# EAGLE schematic tappytap_6x6_connopposite (EAGLE 6.5.0)

## Sheet 1 of 4
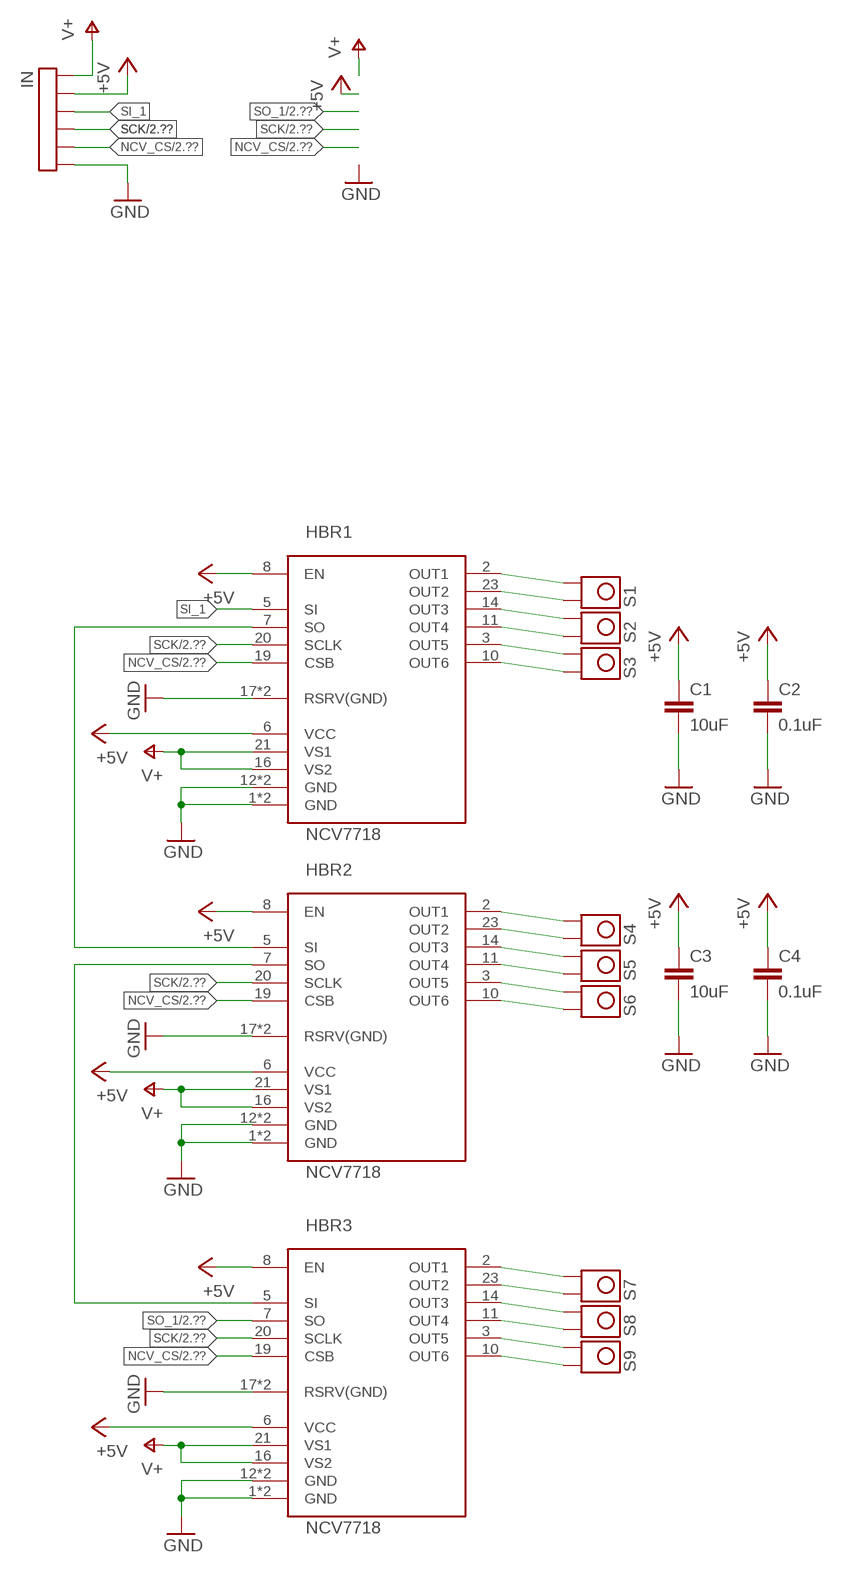
[diagram p0: schematic, sheet 1]

### Parts
C1  10uF  C-EUC0603  [C0603]
C2  0.1uF  C-EUC0603  [C0603]
C3  10uF  C-EUC0603  [C0603]
C4  0.1uF  C-EUC0603  [C0603]
HBR1  NCV7718  [SSOP-24]
HBR2  NCV7718  [SSOP-24]
HBR3  NCV7718  [SSOP-24]
IN  TP6  [TP6_2MM]
S1  TP_6MM_BIG_PAD  [TP_6MM_BIG_PAD]
S2  TP_6MM_BIG_PAD  [TP_6MM_BIG_PAD]
S3  TP_6MM_BIG_PAD  [TP_6MM_BIG_PAD]
S4  TP_6MM_BIG_PAD  [TP_6MM_BIG_PAD]
S5  TP_6MM_BIG_PAD  [TP_6MM_BIG_PAD]
S6  TP_6MM_BIG_PAD  [TP_6MM_BIG_PAD]
S7  TP_6MM_BIG_PAD  [TP_6MM_BIG_PAD]
S8  TP_6MM_BIG_PAD  [TP_6MM_BIG_PAD]
S9  TP_6MM_BIG_PAD  [TP_6MM_BIG_PAD]

### Nets
+5V [usbvcc]: C1.1 C2.1 C3.1 C4.1 HBR1.6(VCC) HBR1.8(EN) HBR2.6(VCC) HBR2.8(EN) HBR3.6(VCC) HBR3.8(EN) IN.P$5 ; also sheet 2,3,4
GND [gnd]: C1.2 C2.2 C3.2 C4.2 HBR1.1(GND) HBR1.12(GND) HBR1.13(GND) HBR1.17(RSRV(GND)) HBR1.18(RSRV(GND)) HBR1.24(GND) HBR2.1(GND) HBR2.12(GND) HBR2.13(GND) HBR2.17(RSRV(GND)) HBR2.18(RSRV(GND)) HBR2.24(GND) HBR3.1(GND) HBR3.12(GND) HBR3.13(GND) HBR3.17(RSRV(GND)) HBR3.18(RSRV(GND)) HBR3.24(GND) IN.P$1 ; also sheet 2,3,4
N$24: HBR1.7(SO) HBR2.5(SI)
N$26: HBR2.7(SO) HBR3.5(SI)
NCV_CS: HBR1.19(CSB) HBR2.19(CSB) HBR3.19(CSB) IN.P$2 ; also sheet 2,3,4
S1A: HBR1.2(OUT1) S1.P$1
S1B: HBR1.23(OUT2) S1.P$2
S2A: HBR1.14(OUT3) S2.P$1
S2B: HBR1.11(OUT4) S2.P$2
S3A: HBR1.3(OUT5) S3.P$1
S3B: HBR1.10(OUT6) S3.P$2
S4A: HBR2.2(OUT1) S4.P$1
S4B: HBR2.23(OUT2) S4.P$2
S5A: HBR2.14(OUT3) S5.P$1
S5B: HBR2.11(OUT4) S5.P$2
S6A: HBR2.3(OUT5) S6.P$1
S6B: HBR2.10(OUT6) S6.P$2
S7A: HBR3.2(OUT1) S7.P$1
S7B: HBR3.23(OUT2) S7.P$2
S8A: HBR3.14(OUT3) S8.P$1
S8B: HBR3.11(OUT4) S8.P$2
S9A: HBR3.3(OUT5) S9.P$1
S9B: HBR3.10(OUT6) S9.P$2
SCK: HBR1.20(SCLK) HBR2.20(SCLK) HBR3.20(SCLK) IN.P$3 ; also sheet 2,3,4
SI_1: HBR1.5(SI) IN.P$4
SO_1: HBR3.7(SO) ; also sheet 2
V+: HBR1.16(VS2) HBR1.21(VS1) HBR2.16(VS2) HBR2.21(VS1) HBR3.16(VS2) HBR3.21(VS1) IN.P$6 ; also sheet 2,3,4

## Sheet 2 of 4
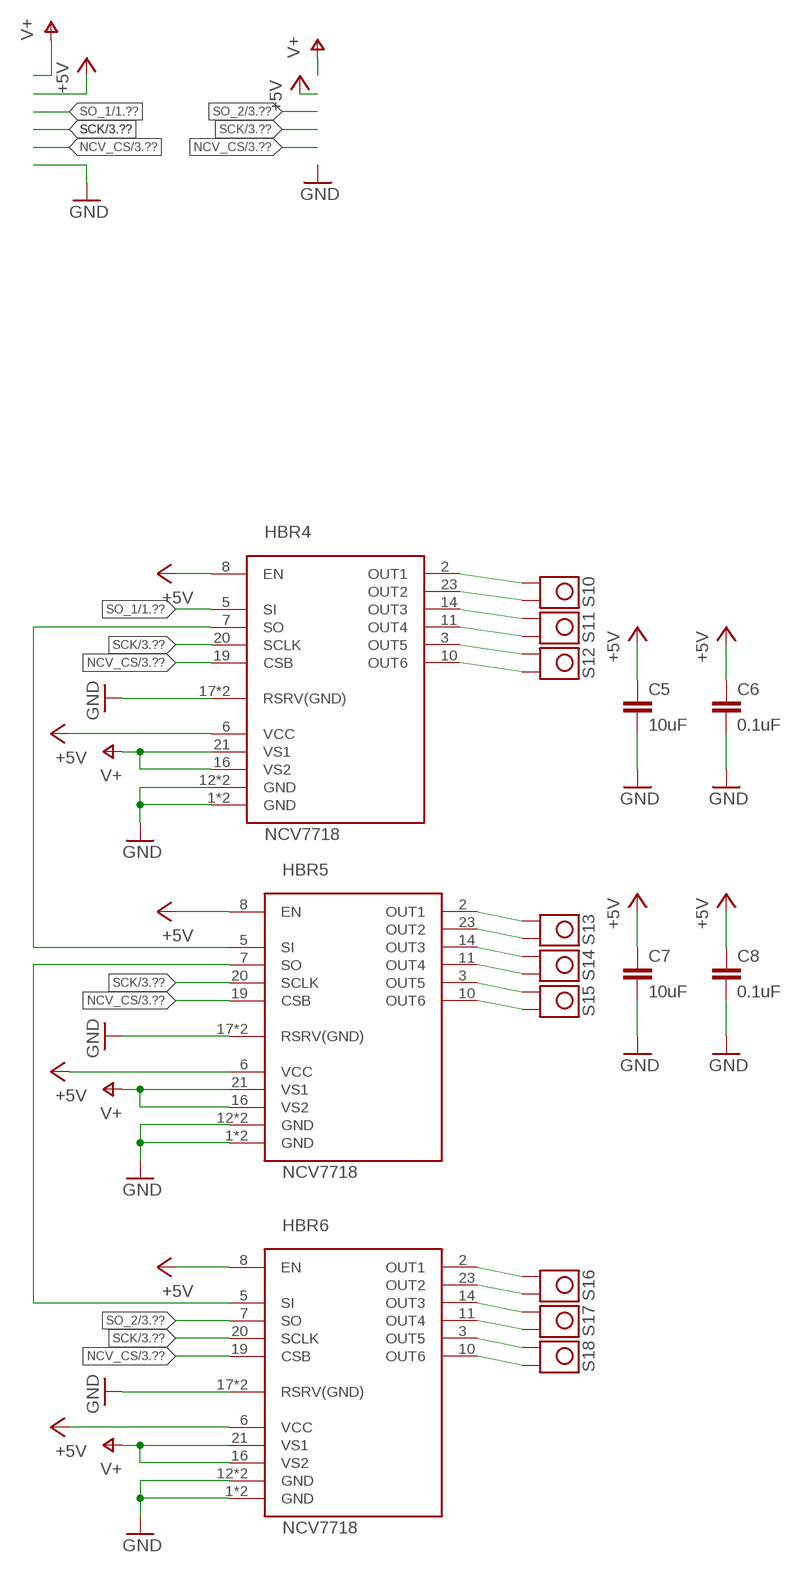
[diagram p1: schematic, sheet 2]

### Parts
C5  10uF  C-EUC0603  [C0603]
C6  0.1uF  C-EUC0603  [C0603]
C7  10uF  C-EUC0603  [C0603]
C8  0.1uF  C-EUC0603  [C0603]
HBR4  NCV7718  [SSOP-24]
HBR5  NCV7718  [SSOP-24]
HBR6  NCV7718  [SSOP-24]
S10  TP_6MM_BIG_PAD  [TP_6MM_BIG_PAD]
S11  TP_6MM_BIG_PAD  [TP_6MM_BIG_PAD]
S12  TP_6MM_BIG_PAD  [TP_6MM_BIG_PAD]
S13  TP_6MM_BIG_PAD  [TP_6MM_BIG_PAD]
S14  TP_6MM_BIG_PAD  [TP_6MM_BIG_PAD]
S15  TP_6MM_BIG_PAD  [TP_6MM_BIG_PAD]
S16  TP_6MM_BIG_PAD  [TP_6MM_BIG_PAD]
S17  TP_6MM_BIG_PAD  [TP_6MM_BIG_PAD]
S18  TP_6MM_BIG_PAD  [TP_6MM_BIG_PAD]

### Nets
+5V [usbvcc]: C5.1 C6.1 C7.1 C8.1 HBR4.6(VCC) HBR4.8(EN) HBR5.6(VCC) HBR5.8(EN) HBR6.6(VCC) HBR6.8(EN) ; also sheet 1,3,4
GND [gnd]: C5.2 C6.2 C7.2 C8.2 HBR4.1(GND) HBR4.12(GND) HBR4.13(GND) HBR4.17(RSRV(GND)) HBR4.18(RSRV(GND)) HBR4.24(GND) HBR5.1(GND) HBR5.12(GND) HBR5.13(GND) HBR5.17(RSRV(GND)) HBR5.18(RSRV(GND)) HBR5.24(GND) HBR6.1(GND) HBR6.12(GND) HBR6.13(GND) HBR6.17(RSRV(GND)) HBR6.18(RSRV(GND)) HBR6.24(GND) ; also sheet 1,3,4
N$1: HBR4.7(SO) HBR5.5(SI)
N$2: HBR5.7(SO) HBR6.5(SI)
NCV_CS: HBR4.19(CSB) HBR5.19(CSB) HBR6.19(CSB) ; also sheet 1,3,4
S1A1: HBR4.2(OUT1) S10.P$1
S1B1: HBR4.23(OUT2) S10.P$2
S2A1: HBR4.14(OUT3) S11.P$1
S2B1: HBR4.11(OUT4) S11.P$2
S3A1: HBR4.3(OUT5) S12.P$1
S3B1: HBR4.10(OUT6) S12.P$2
S4A1: HBR5.2(OUT1) S13.P$1
S4B1: HBR5.23(OUT2) S13.P$2
S5A1: HBR5.14(OUT3) S14.P$1
S5B1: HBR5.11(OUT4) S14.P$2
S6A1: HBR5.3(OUT5) S15.P$1
S6B1: HBR5.10(OUT6) S15.P$2
S7A1: HBR6.2(OUT1) S16.P$1
S7B1: HBR6.23(OUT2) S16.P$2
S8A1: HBR6.14(OUT3) S17.P$1
S8B1: HBR6.11(OUT4) S17.P$2
S9A1: HBR6.3(OUT5) S18.P$1
S9B1: HBR6.10(OUT6) S18.P$2
SCK: HBR4.20(SCLK) HBR5.20(SCLK) HBR6.20(SCLK) ; also sheet 1,3,4
SO_1: HBR4.5(SI) ; also sheet 1
SO_2: HBR6.7(SO) ; also sheet 3
V+: HBR4.16(VS2) HBR4.21(VS1) HBR5.16(VS2) HBR5.21(VS1) HBR6.16(VS2) HBR6.21(VS1) ; also sheet 1,3,4

## Sheet 3 of 4
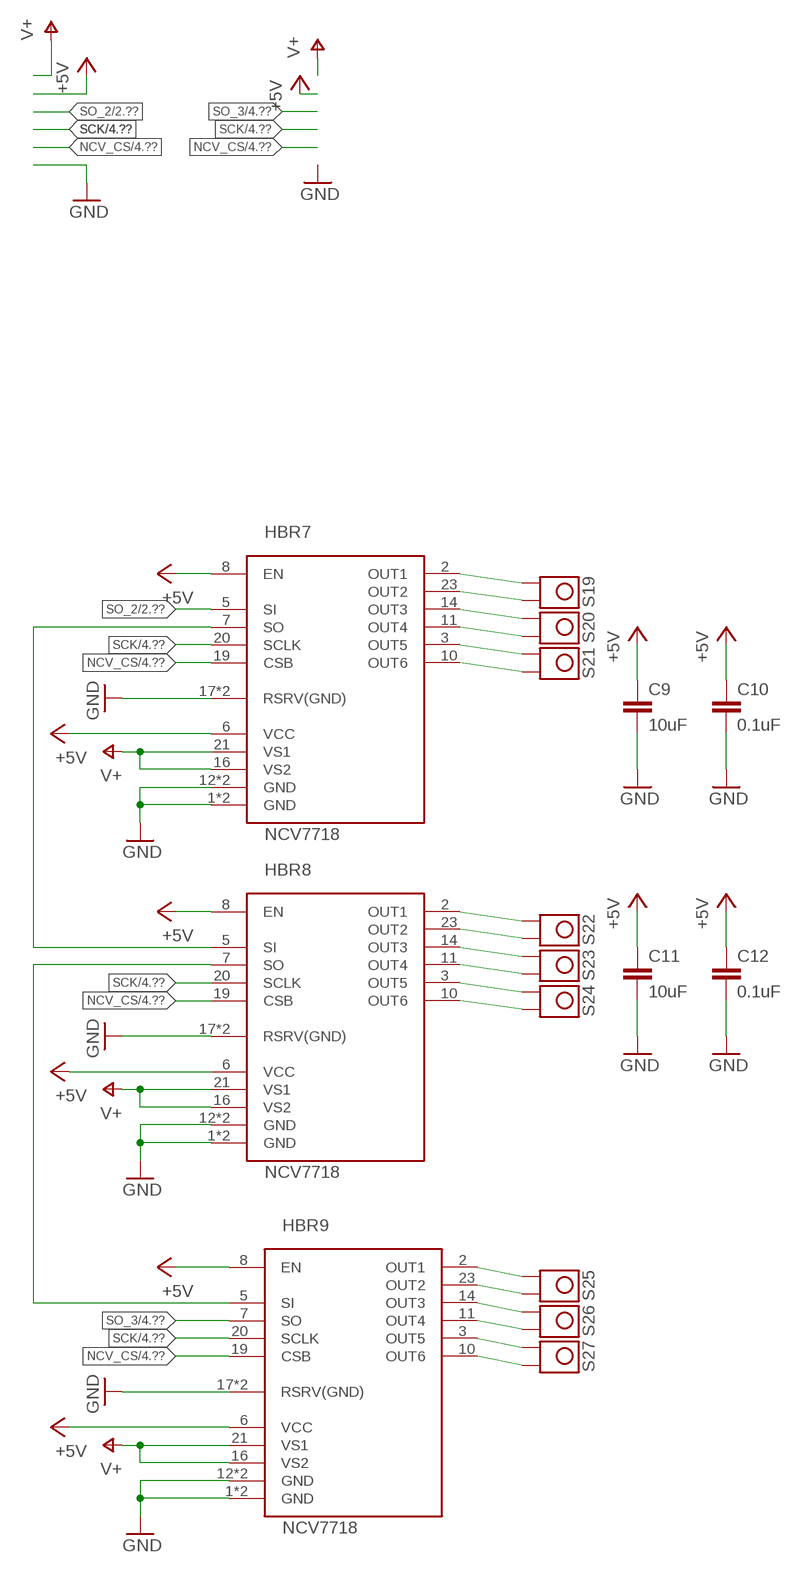
[diagram p2: schematic, sheet 3]

### Parts
C9  10uF  C-EUC0603  [C0603]
C10  0.1uF  C-EUC0603  [C0603]
C11  10uF  C-EUC0603  [C0603]
C12  0.1uF  C-EUC0603  [C0603]
HBR7  NCV7718  [SSOP-24]
HBR8  NCV7718  [SSOP-24]
HBR9  NCV7718  [SSOP-24]
S19  TP_6MM_BIG_PAD  [TP_6MM_BIG_PAD]
S20  TP_6MM_BIG_PAD  [TP_6MM_BIG_PAD]
S21  TP_6MM_BIG_PAD  [TP_6MM_BIG_PAD]
S22  TP_6MM_BIG_PAD  [TP_6MM_BIG_PAD]
S23  TP_6MM_BIG_PAD  [TP_6MM_BIG_PAD]
S24  TP_6MM_BIG_PAD  [TP_6MM_BIG_PAD]
S25  TP_6MM_BIG_PAD  [TP_6MM_BIG_PAD]
S26  TP_6MM_BIG_PAD  [TP_6MM_BIG_PAD]
S27  TP_6MM_BIG_PAD  [TP_6MM_BIG_PAD]

### Nets
+5V [usbvcc]: C9.1 C10.1 C11.1 C12.1 HBR7.6(VCC) HBR7.8(EN) HBR8.6(VCC) HBR8.8(EN) HBR9.6(VCC) HBR9.8(EN) ; also sheet 1,2,4
GND [gnd]: C9.2 C10.2 C11.2 C12.2 HBR7.1(GND) HBR7.12(GND) HBR7.13(GND) HBR7.17(RSRV(GND)) HBR7.18(RSRV(GND)) HBR7.24(GND) HBR8.1(GND) HBR8.12(GND) HBR8.13(GND) HBR8.17(RSRV(GND)) HBR8.18(RSRV(GND)) HBR8.24(GND) HBR9.1(GND) HBR9.12(GND) HBR9.13(GND) HBR9.17(RSRV(GND)) HBR9.18(RSRV(GND)) HBR9.24(GND) ; also sheet 1,2,4
N$3: HBR7.7(SO) HBR8.5(SI)
N$4: HBR8.7(SO) HBR9.5(SI)
NCV_CS: HBR7.19(CSB) HBR8.19(CSB) HBR9.19(CSB) ; also sheet 1,2,4
S1A2: HBR7.2(OUT1) S19.P$1
S1B2: HBR7.23(OUT2) S19.P$2
S2A2: HBR7.14(OUT3) S20.P$1
S2B2: HBR7.11(OUT4) S20.P$2
S3A2: HBR7.3(OUT5) S21.P$1
S3B2: HBR7.10(OUT6) S21.P$2
S4A2: HBR8.2(OUT1) S22.P$1
S4B2: HBR8.23(OUT2) S22.P$2
S5A2: HBR8.14(OUT3) S23.P$1
S5B2: HBR8.11(OUT4) S23.P$2
S6A2: HBR8.3(OUT5) S24.P$1
S6B2: HBR8.10(OUT6) S24.P$2
S7A2: HBR9.2(OUT1) S25.P$1
S7B2: HBR9.23(OUT2) S25.P$2
S8A2: HBR9.14(OUT3) S26.P$1
S8B2: HBR9.11(OUT4) S26.P$2
S9A2: HBR9.3(OUT5) S27.P$1
S9B2: HBR9.10(OUT6) S27.P$2
SCK: HBR7.20(SCLK) HBR8.20(SCLK) HBR9.20(SCLK) ; also sheet 1,2,4
SO_2: HBR7.5(SI) ; also sheet 2
SO_3: HBR9.7(SO) ; also sheet 4
V+: HBR7.16(VS2) HBR7.21(VS1) HBR8.16(VS2) HBR8.21(VS1) HBR9.16(VS2) HBR9.21(VS1) ; also sheet 1,2,4

## Sheet 4 of 4
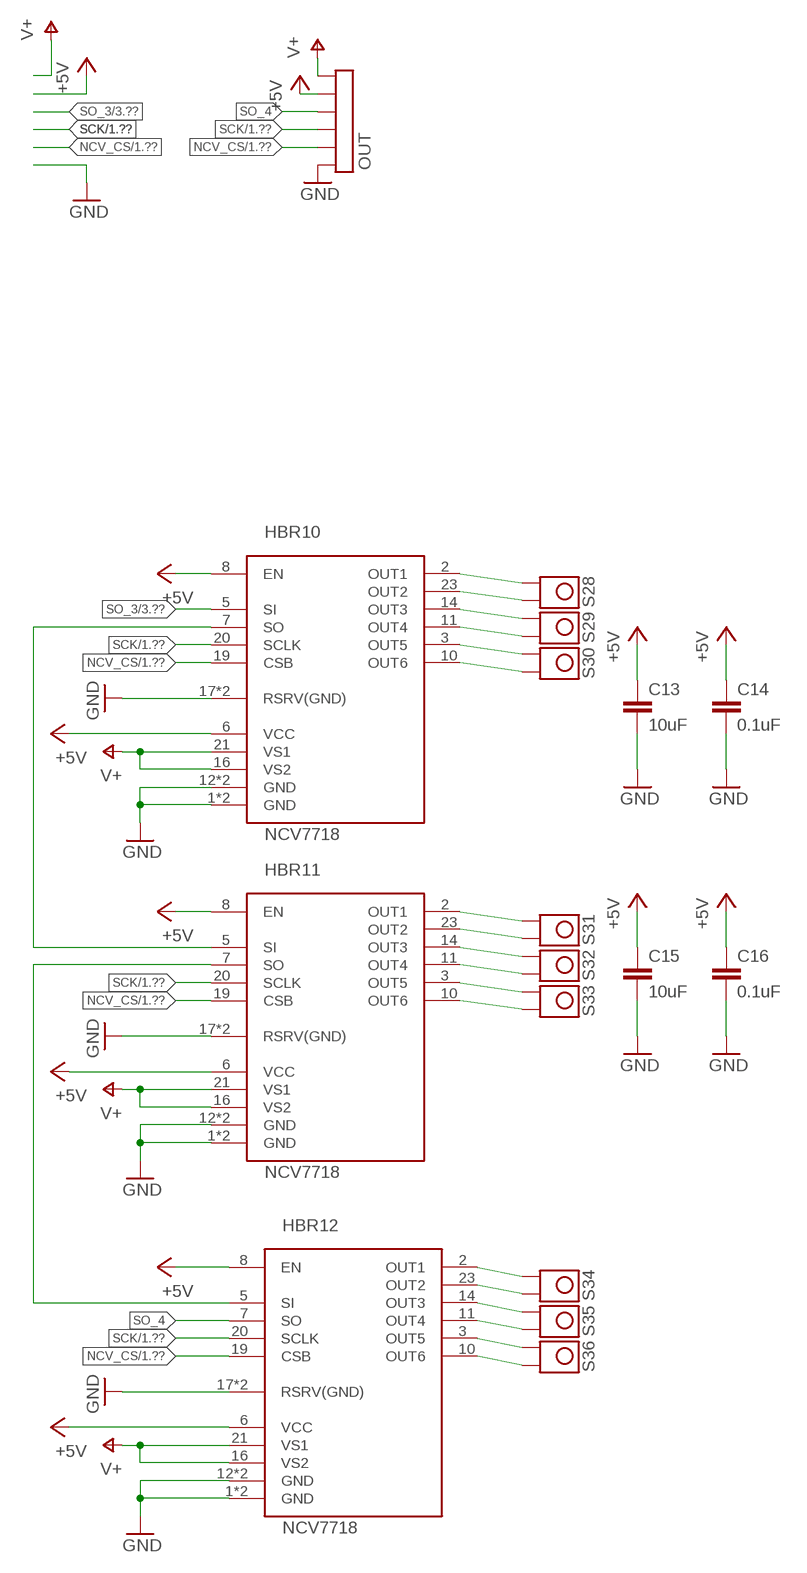
[diagram p3: schematic, sheet 4]

### Parts
C13  10uF  C-EUC0603  [C0603]
C14  0.1uF  C-EUC0603  [C0603]
C15  10uF  C-EUC0603  [C0603]
C16  0.1uF  C-EUC0603  [C0603]
HBR10  NCV7718  [SSOP-24]
HBR11  NCV7718  [SSOP-24]
HBR12  NCV7718  [SSOP-24]
OUT  TP6  [TP6_2MM]
S28  TP_6MM_BIG_PAD  [TP_6MM_BIG_PAD]
S29  TP_6MM_BIG_PAD  [TP_6MM_BIG_PAD]
S30  TP_6MM_BIG_PAD  [TP_6MM_BIG_PAD]
S31  TP_6MM_BIG_PAD  [TP_6MM_BIG_PAD]
S32  TP_6MM_BIG_PAD  [TP_6MM_BIG_PAD]
S33  TP_6MM_BIG_PAD  [TP_6MM_BIG_PAD]
S34  TP_6MM_BIG_PAD  [TP_6MM_BIG_PAD]
S35  TP_6MM_BIG_PAD  [TP_6MM_BIG_PAD]
S36  TP_6MM_BIG_PAD  [TP_6MM_BIG_PAD]

### Nets
+5V [usbvcc]: C13.1 C14.1 C15.1 C16.1 HBR10.6(VCC) HBR10.8(EN) HBR11.6(VCC) HBR11.8(EN) HBR12.6(VCC) HBR12.8(EN) OUT.P$2 ; also sheet 1,2,3
GND [gnd]: C13.2 C14.2 C15.2 C16.2 HBR10.1(GND) HBR10.12(GND) HBR10.13(GND) HBR10.17(RSRV(GND)) HBR10.18(RSRV(GND)) HBR10.24(GND) HBR11.1(GND) HBR11.12(GND) HBR11.13(GND) HBR11.17(RSRV(GND)) HBR11.18(RSRV(GND)) HBR11.24(GND) HBR12.1(GND) HBR12.12(GND) HBR12.13(GND) HBR12.17(RSRV(GND)) HBR12.18(RSRV(GND)) HBR12.24(GND) OUT.P$6 ; also sheet 1,2,3
N$5: HBR10.7(SO) HBR11.5(SI)
N$6: HBR11.7(SO) HBR12.5(SI)
NCV_CS: HBR10.19(CSB) HBR11.19(CSB) HBR12.19(CSB) OUT.P$5 ; also sheet 1,2,3
S1A3: HBR10.2(OUT1) S28.P$1
S1B3: HBR10.23(OUT2) S28.P$2
S2A3: HBR10.14(OUT3) S29.P$1
S2B3: HBR10.11(OUT4) S29.P$2
S3A3: HBR10.3(OUT5) S30.P$1
S3B3: HBR10.10(OUT6) S30.P$2
S4A3: HBR11.2(OUT1) S31.P$1
S4B3: HBR11.23(OUT2) S31.P$2
S5A3: HBR11.14(OUT3) S32.P$1
S5B3: HBR11.11(OUT4) S32.P$2
S6A3: HBR11.3(OUT5) S33.P$1
S6B3: HBR11.10(OUT6) S33.P$2
S7A3: HBR12.2(OUT1) S34.P$1
S7B3: HBR12.23(OUT2) S34.P$2
S8A3: HBR12.14(OUT3) S35.P$1
S8B3: HBR12.11(OUT4) S35.P$2
S9A3: HBR12.3(OUT5) S36.P$1
S9B3: HBR12.10(OUT6) S36.P$2
SCK: HBR10.20(SCLK) HBR11.20(SCLK) HBR12.20(SCLK) OUT.P$4 ; also sheet 1,2,3
SO_3: HBR10.5(SI) ; also sheet 3
SO_4: HBR12.7(SO) OUT.P$3
V+: HBR10.16(VS2) HBR10.21(VS1) HBR11.16(VS2) HBR11.21(VS1) HBR12.16(VS2) HBR12.21(VS1) OUT.P$1 ; also sheet 1,2,3

## Library data of the parts
C1-C16 = rcl:C-EU: CAPACITOR, European symbol
HBR1-HBR12 = Sparky:NCV7718: Hex Half−Bridge Driver. The device can be operated in forward, reverse, brake, and high impedance states. The drivers are controlled via a 16 bit SPI interface and are daisy chain compatible.
IN OUT = Sparky:TP6
S1-S36 = tom-tap:TP_6MM_BIG_PAD